# EAGLE schematic fuzz (EAGLE 6.4)
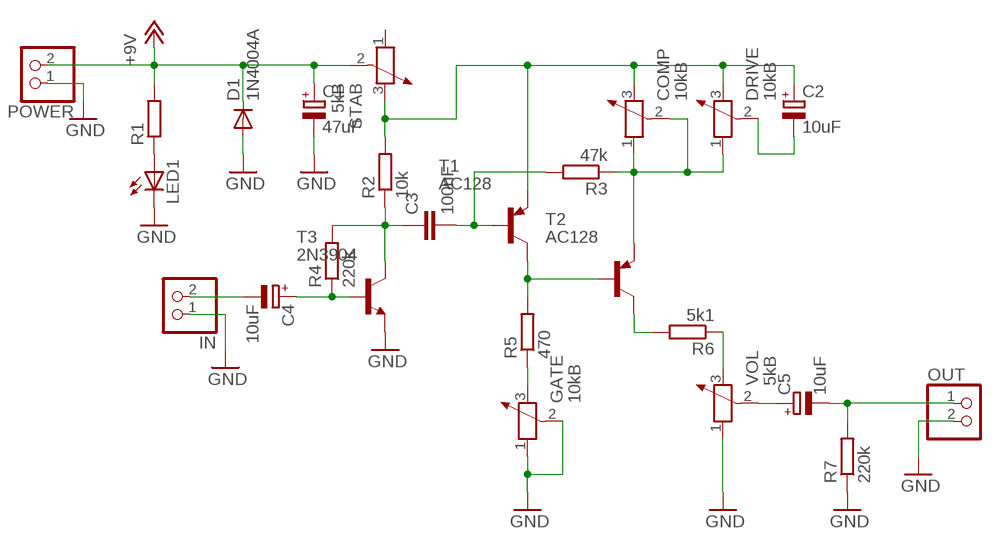
[diagram p0: schematic, sheet 1]

## Parts
C1  47uF  CPOL-EUE2.5-6  [E2,5-6]
C2  10uF  CPOL-EUE2.5-6  [E2,5-6]
C3  100nF  C-EU050-045X075  [C050-045X075]
C4  10uF  CPOL-EUE2.5-6  [E2,5-6]
C5  10uF  CPOL-EUE2.5-6  [E2,5-6]
COMP  10kB  POTENTIOMETER_  [1X03]
D1  1N4004A  [DO41-5]
DRIVE  10kB  POTENTIOMETER_  [1X03]
GATE  10kB  POTENTIOMETER_  [1X03]
IN  PINHD-1X2  [1X02]
LED1  LED3MM  [LED3MM]
OUT  PINHD-1X2  [1X02]
POWER  PINHD-1X2  [1X02]
R1  R-EU_  [R0805]
R2  10k  R-EU_0207/7  [0207/7]
R3  47k  R-EU_0207/7  [0207/7]
R4  220k  R-EU_0207/7  [0207/7]
R5  470  R-EU_0207/7  [0207/7]
R6  5k1  R-EU_0207/7  [0207/7]
R7  220k  R-EU_0207/7  [0207/7]
STAB  5kB  POTENTIOMETER_  [1X03]
T1  AC128  [TO18]
T2  AC128  [TO18]
T3  2N3904  [TO92]
VOL  5kB  POTENTIOMETER_  [1X03]

## Nets
+12V: C1.+ D1.C POWER.2 R1.2 STAB.2 ; supply symbol labelled +9V
GND: C1.- D1.A GATE.1 GATE.2 IN.1 LED1.K(C) OUT.2 POWER.1 R7.1 T3.3(E) VOL.1
N$1: LED1.A R1.1
N$2: C4.+ R4.1 T3.2(B)
N$3: C2.+ COMP.3 DRIVE.3 R2.2 STAB.3 T1.1(E)
N$4: C3.1 R2.1 R4.2 T3.1(C)
N$5: C3.2 R3.2 T1.2(B)
N$6: C2.- DRIVE.2
N$7: COMP.1 COMP.2 DRIVE.1 R3.1 T2.1(E)
N$8: R5.2 T1.3(C) T2.2(B)
N$9: GATE.3 R5.1
N$10: R6.2 T2.3(C)
N$11: R6.1 VOL.3
N$12: C5.+ VOL.2
N$13: C5.- OUT.1 R7.2
N$14: C4.- IN.2
Unconnected: STAB.1

## Library data of the parts
C1 C2 C4 C5 = fuzz:CPOL-EU: POLARIZED CAPACITOR, European symbol
C3 = fuzz:C-EU: CAPACITOR, European symbol
COMP DRIVE GATE STAB VOL = fuzz:POTENTIOMETER_: Potentiometer
D1 = fuzz:1N4004: DIODE general purpose rectifier, 1 A
IN OUT POWER = fuzz:PINHD-1X2: PIN HEADER
LED1 = fuzz:LED
R1-R7 = fuzz:R-EU_: RESISTOR, European symbol
T1 T2 = fuzz:AC128: PNP TRANSISTOR
T3 = fuzz:2N3904: NPN TRANSISTOR